# Altium schematic sheet 海关全向控制器数传转接板V4.SchDoc
size A4
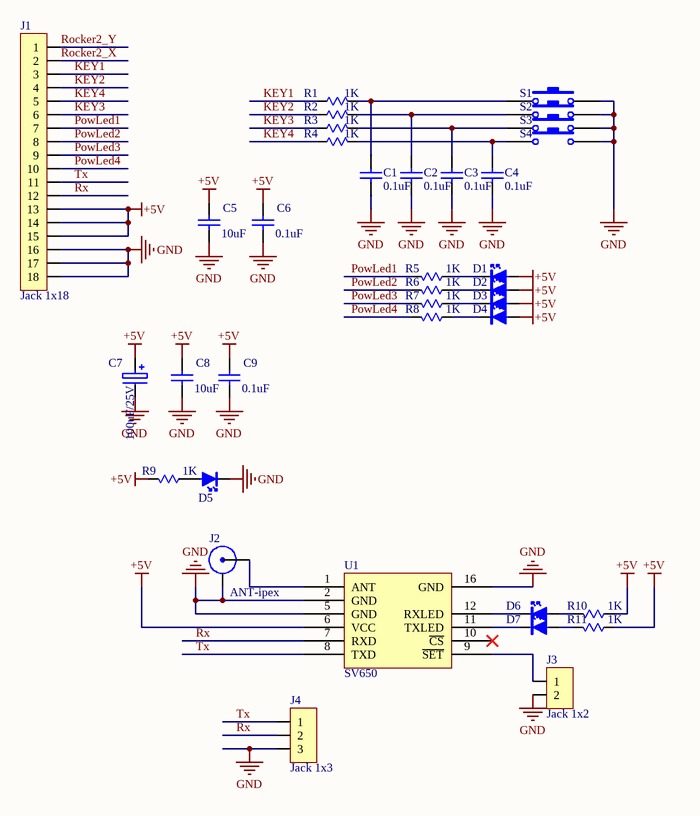
[diagram p0: 海关全向控制器数传转接板V4.SchDoc]

## Parts
C1  0.1uF  [C0805]
C2  0.1uF  [C0805]
C3  0.1uF  [C0805]
C4  0.1uF  [C0805]
C5  10uF  [C0805]
C6  0.1uF  [C0805]
C7  100uF/25V  [C7343]
C8  10uF  [C0805]
C9  0.1uF  [C0805]
D1  LED  [LED0805]  (value not drawn)
D2  LED  [LED0805]  (value not drawn)
D3  LED  [LED0805]  (value not drawn)
D4  LED  [LED0805]  (value not drawn)
D5  LED  [LED0805]  (value not drawn)
D6  LED  [LED0805]  (value not drawn)
D7  LED  [LED0805]  (value not drawn)
J1  Jack 1x18  [0.5S-6X-18PB]
J2  ANT-ipex  [IPEX]
J3  Jack 1x2  [A6S-1101-PH]
J4  Jack 1x3  [Jk1*3-2.0]
R1  1K  [R0805]
R2  1K  [R0805]
R3  1K  [R0805]
R4  1K  [R0805]
R5  1K  [R0805]
R6  1K  [R0805]
R7  1K  [R0805]
R8  1K  [R0805]
R9  1K  [R0805]
R10  1K  [R0805]
R11  1K  [R0805]
S1  SW-PB  [SW3X6X5]  (value not drawn)
S2  SW-PB  [SW3X6X5]  (value not drawn)
S3  SW-PB  [SW3X6X5]  (value not drawn)
S4  SW-PB  [SW3X6X5]  (value not drawn)
U1  SV650  [SV650]

## Nets
+5V: C5.2 C6.2 C7.1 C8.2 C9.2 D1.1(A) D2.1(A) D3.1(A) D4.1(A) J1.13 J1.14 J1.15 R9.2 R10.1 R11.1 U1.6(VCC)
GND: C1.1 C2.1 C3.1 C4.1 C5.1 C6.1 C7.2 C8.1 C9.1 D5.2(K) J1.16 J1.17 J1.18 J2.2(GND) J3.2 J4.3 S1.2 S2.2 S3.2 S4.2 U1.2(GND) U1.5(GND) U1.16(GND)
KEY1: J1.3 R1.1
KEY2: J1.4 R2.1
KEY3: J1.6 R3.1
KEY4: J1.5 R4.1
PowLed1: J1.7 R5.2
PowLed2: J1.8 R6.2
PowLed3: J1.9 R7.2
PowLed4: J1.10 R8.2
Rocker2_X: J1.2
Rocker2_Y: J1.1
Rx: J1.12 J4.2 U1.7(RXD)
Tx: J1.11 J4.1 U1.8(TXD)
NetC1_2: C1.2 R1.2 S1.1
NetC2_2: C2.2 R2.2 S2.1
NetC3_2: C3.2 R3.2 S3.1
NetC4_2: C4.2 R4.2 S4.1
NetD1_2: D1.2(K) R5.1
NetD2_2: D2.2(K) R6.1
NetD3_2: D3.2(K) R7.1
NetD4_2: D4.2(K) R8.1
NetD5_1: D5.1(A) R9.1
NetD6_1: D6.1(A) R10.2
NetD6_2: D6.2(K) U1.12(RXLED)
NetD7_1: D7.1(A) R11.2
NetD7_2: D7.2(K) U1.11(TXLED)
NetJ2_1: J2.1(ANT) U1.1(ANT)
NetJ3_1: J3.1 U1.9(~{SET})

Not connected (* = marked no-connect by the designer): U1 10(~{CS})*

## Library data of the parts
C1-C6 C8 C9 = Cap Semi
C7 = Cap Poll
J1 = Jack 1x18: 插座
J3 = Jack 1x2: 插座
J4 = Jack 1x3: 插座
R1-R11 = Res: Resistor; Published: 8-Jun-2000; LatestRevisionDate: 04-Mar-2005; LatestRevisionNote: PCB Footprint replaced.; PackageReference: J1-0603; Publisher: Altium Limited
S1-S4 = SW-PB: Switch; Published: 24-Mar-1999; LatestRevisionDate: 17-Jul-2002; LatestRevisionNote: Re-released for DXP Platform.; PackageReference: SPST-2; Publisher: Altium Limited; PackageDescription: Switch; 2 Leads